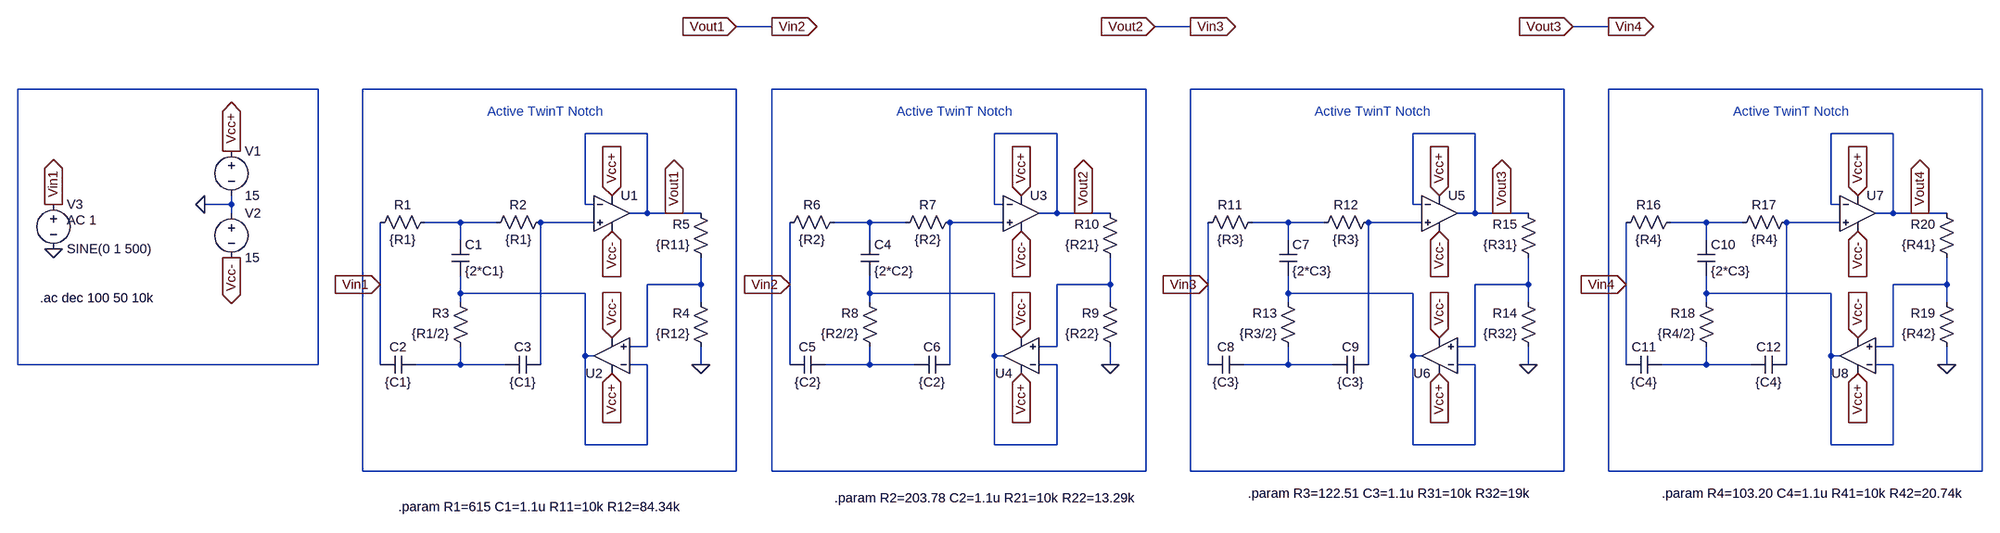
[diagram p0: schematic cascade.asc]
cascade.asc, the LTspice schematic file:
Version 4
SHEET 1 2720 680
WIRE 528 -240 464 -240
WIRE 1280 -240 1216 -240
WIRE 2032 -240 1968 -240
WIRE -288 -128 -848 -128
WIRE 464 -128 -208 -128
WIRE 1200 -128 528 -128
WIRE 1952 -128 1280 -128
WIRE 2704 -128 2032 -128
WIRE 304 -48 192 -48
WIRE 1040 -48 928 -48
WIRE 1792 -48 1680 -48
WIRE 2544 -48 2432 -48
WIRE -464 80 -464 64
WIRE -464 80 -512 80
WIRE 192 80 192 -48
WIRE 208 80 192 80
WIRE 928 80 928 -48
WIRE 944 80 928 80
WIRE 1680 80 1680 -48
WIRE 1696 80 1680 80
WIRE 2432 80 2432 -48
WIRE 2448 80 2432 80
WIRE -464 96 -464 80
WIRE 304 96 304 -48
WIRE 304 96 272 96
WIRE 352 96 304 96
WIRE 400 96 352 96
WIRE 1040 96 1040 -48
WIRE 1040 96 1008 96
WIRE 1088 96 1040 96
WIRE 1136 96 1088 96
WIRE 1792 96 1792 -48
WIRE 1792 96 1760 96
WIRE 1840 96 1792 96
WIRE 1888 96 1840 96
WIRE 2544 96 2544 -48
WIRE 2544 96 2512 96
WIRE 2592 96 2544 96
WIRE 2640 96 2592 96
WIRE -32 112 -96 112
WIRE 32 112 -32 112
WIRE 208 112 112 112
WIRE 704 112 640 112
WIRE 768 112 704 112
WIRE 944 112 848 112
WIRE 1456 112 1392 112
WIRE 1520 112 1456 112
WIRE 1696 112 1600 112
WIRE 2208 112 2144 112
WIRE 2272 112 2208 112
WIRE 2448 112 2352 112
WIRE -32 144 -32 112
WIRE 704 144 704 112
WIRE 1456 144 1456 112
WIRE 2208 144 2208 112
WIRE -176 224 -176 112
WIRE 400 224 400 176
WIRE 400 224 304 224
WIRE 560 224 560 112
WIRE 1136 224 1136 176
WIRE 1136 224 1040 224
WIRE 1312 224 1312 112
WIRE 1888 224 1888 176
WIRE 1888 224 1792 224
WIRE 2064 224 2064 112
WIRE 2640 224 2640 176
WIRE 2640 224 2544 224
WIRE -32 240 -32 208
WIRE 192 240 -32 240
WIRE 704 240 704 208
WIRE 928 240 704 240
WIRE 1456 240 1456 208
WIRE 1680 240 1456 240
WIRE 2208 240 2208 208
WIRE 2432 240 2208 240
WIRE -32 256 -32 240
WIRE 400 256 400 224
WIRE 704 256 704 240
WIRE 1136 256 1136 224
WIRE 1456 256 1456 240
WIRE 1888 256 1888 224
WIRE 2208 256 2208 240
WIRE 2640 256 2640 224
WIRE 304 336 304 224
WIRE 304 336 272 336
WIRE 1040 336 1040 224
WIRE 1040 336 1008 336
WIRE 1792 336 1792 224
WIRE 1792 336 1760 336
WIRE 2544 336 2544 224
WIRE 2544 336 2512 336
WIRE 192 352 192 240
WIRE 208 352 192 352
WIRE 928 352 928 240
WIRE 944 352 928 352
WIRE 1680 352 1680 240
WIRE 1696 352 1680 352
WIRE 2432 352 2432 240
WIRE 2448 352 2432 352
WIRE -848 368 -848 -128
WIRE -288 368 -288 -128
WIRE -288 368 -848 368
WIRE -176 368 -176 224
WIRE -32 368 -32 336
WIRE -32 368 -112 368
WIRE 48 368 -32 368
WIRE 112 368 112 112
WIRE 304 368 272 368
WIRE 400 368 400 336
WIRE 560 368 560 224
WIRE 704 368 704 336
WIRE 704 368 624 368
WIRE 784 368 704 368
WIRE 848 368 848 112
WIRE 1040 368 1008 368
WIRE 1136 368 1136 336
WIRE 1312 368 1312 224
WIRE 1456 368 1456 336
WIRE 1456 368 1376 368
WIRE 1536 368 1456 368
WIRE 1600 368 1600 112
WIRE 1792 368 1760 368
WIRE 1888 368 1888 336
WIRE 2064 368 2064 224
WIRE 2208 368 2208 336
WIRE 2208 368 2128 368
WIRE 2288 368 2208 368
WIRE 2352 368 2352 112
WIRE 2544 368 2512 368
WIRE 2640 368 2640 336
WIRE 192 512 192 352
WIRE 304 512 304 368
WIRE 304 512 192 512
WIRE 928 512 928 352
WIRE 1040 512 1040 368
WIRE 1040 512 928 512
WIRE 1680 512 1680 352
WIRE 1792 512 1792 368
WIRE 1792 512 1680 512
WIRE 2432 512 2432 352
WIRE 2544 512 2544 368
WIRE 2544 512 2432 512
WIRE -208 560 -208 -128
WIRE 464 560 464 -128
WIRE 464 560 -208 560
WIRE 528 560 528 -128
WIRE 1200 560 1200 -128
WIRE 1200 560 528 560
WIRE 1280 560 1280 -128
WIRE 1952 560 1952 -128
WIRE 1952 560 1280 560
WIRE 2032 560 2032 -128
WIRE 2704 560 2704 -128
WIRE 2704 560 2032 560
FLAG 400 368 0
FLAG 240 384 Vcc+
IOPIN 240 384 In
FLAG 240 64 Vcc+
IOPIN 240 64 In
FLAG 240 128 Vcc-
IOPIN 240 128 In
FLAG 240 320 Vcc-
IOPIN 240 320 In
FLAG -176 224 Vin1
IOPIN -176 224 In
FLAG 352 96 Vout1
IOPIN 352 96 Out
FLAG -464 -16 Vcc+
IOPIN -464 -16 Out
FLAG -464 176 Vcc-
IOPIN -464 176 Out
FLAG -512 80 0
FLAG -784 160 0
FLAG -784 80 Vin1
IOPIN -784 80 Out
FLAG 1136 368 0
FLAG 976 384 Vcc+
IOPIN 976 384 In
FLAG 976 64 Vcc+
IOPIN 976 64 In
FLAG 976 128 Vcc-
IOPIN 976 128 In
FLAG 976 320 Vcc-
IOPIN 976 320 In
FLAG 560 224 Vin2
IOPIN 560 224 In
FLAG 1088 96 Vout2
IOPIN 1088 96 Out
FLAG 1888 368 0
FLAG 1728 384 Vcc+
IOPIN 1728 384 In
FLAG 1728 64 Vcc+
IOPIN 1728 64 In
FLAG 1728 128 Vcc-
IOPIN 1728 128 In
FLAG 1728 320 Vcc-
IOPIN 1728 320 In
FLAG 1312 224 Vin3
IOPIN 1312 224 In
FLAG 1840 96 Vout3
IOPIN 1840 96 Out
FLAG 2640 368 0
FLAG 2480 384 Vcc+
IOPIN 2480 384 In
FLAG 2480 64 Vcc+
IOPIN 2480 64 In
FLAG 2480 128 Vcc-
IOPIN 2480 128 In
FLAG 2480 320 Vcc-
IOPIN 2480 320 In
FLAG 2064 224 Vin4
IOPIN 2064 224 In
FLAG 2592 96 Vout4
IOPIN 2592 96 Out
FLAG 464 -240 Vout1
IOPIN 464 -240 In
FLAG 528 -240 Vin2
IOPIN 528 -240 Out
FLAG 1216 -240 Vout2
IOPIN 1216 -240 In
FLAG 1280 -240 Vin3
IOPIN 1280 -240 Out
FLAG 1968 -240 Vout3
IOPIN 1968 -240 In
FLAG 2032 -240 Vin4
IOPIN 2032 -240 Out
SYMBOL res -80 96 R90
WINDOW 0 0 56 VBottom 2
WINDOW 3 32 56 VTop 2
SYMATTR InstName R1
SYMATTR Value {R1}
SYMBOL res 128 96 R90
WINDOW 0 0 56 VBottom 2
WINDOW 3 32 56 VTop 2
SYMATTR InstName R2
SYMATTR Value {R1}
SYMBOL res -16 352 R180
WINDOW 0 36 76 Left 2
WINDOW 3 36 40 Left 2
SYMATTR InstName R3
SYMATTR Value {R1/2}
SYMBOL res 416 352 R180
WINDOW 0 36 76 Left 2
WINDOW 3 36 40 Left 2
SYMATTR InstName R4
SYMATTR Value {R12}
SYMBOL res 416 192 R180
WINDOW 0 36 76 Left 2
WINDOW 3 36 40 Left 2
SYMATTR InstName R5
SYMATTR Value {R11}
SYMBOL cap -48 144 R0
SYMATTR InstName C1
SYMATTR Value {2*C1}
SYMBOL cap -112 352 R90
WINDOW 0 0 32 VBottom 2
WINDOW 3 32 32 VTop 2
SYMATTR InstName C2
SYMATTR Value {C1}
SYMBOL cap 112 352 R90
WINDOW 0 0 32 VBottom 2
WINDOW 3 32 32 VTop 2
SYMATTR InstName C3
SYMATTR Value {C1}
SYMBOL OpAmps\\UniversalOpAmp 240 96 R0
SYMATTR InstName U1
SYMBOL OpAmps\\UniversalOpAmp 240 352 R180
SYMATTR InstName U2
SYMBOL voltage -464 -32 R0
WINDOW 123 0 0 Left 0
WINDOW 39 0 0 Left 0
SYMATTR InstName V1
SYMATTR Value 15
SYMBOL voltage -464 80 R0
WINDOW 123 0 0 Left 0
WINDOW 39 0 0 Left 0
SYMATTR InstName V2
SYMATTR Value 15
SYMBOL voltage -784 64 R0
WINDOW 123 24 44 Left 2
WINDOW 39 0 0 Left 0
SYMATTR Value2 AC 1
SYMATTR InstName V3
SYMATTR Value SINE(0 1 500)
SYMBOL res 656 96 R90
WINDOW 0 0 56 VBottom 2
WINDOW 3 32 56 VTop 2
SYMATTR InstName R6
SYMATTR Value {R2}
SYMBOL res 864 96 R90
WINDOW 0 0 56 VBottom 2
WINDOW 3 32 56 VTop 2
SYMATTR InstName R7
SYMATTR Value {R2}
SYMBOL res 720 352 R180
WINDOW 0 36 76 Left 2
WINDOW 3 36 40 Left 2
SYMATTR InstName R8
SYMATTR Value {R2/2}
SYMBOL res 1152 352 R180
WINDOW 0 36 76 Left 2
WINDOW 3 36 40 Left 2
SYMATTR InstName R9
SYMATTR Value {R22}
SYMBOL res 1152 192 R180
WINDOW 0 36 76 Left 2
WINDOW 3 36 40 Left 2
SYMATTR InstName R10
SYMATTR Value {R21}
SYMBOL cap 688 144 R0
SYMATTR InstName C4
SYMATTR Value {2*C2}
SYMBOL cap 624 352 R90
WINDOW 0 0 32 VBottom 2
WINDOW 3 32 32 VTop 2
SYMATTR InstName C5
SYMATTR Value {C2}
SYMBOL cap 848 352 R90
WINDOW 0 0 32 VBottom 2
WINDOW 3 32 32 VTop 2
SYMATTR InstName C6
SYMATTR Value {C2}
SYMBOL OpAmps\\UniversalOpAmp 976 96 R0
SYMATTR InstName U3
SYMBOL OpAmps\\UniversalOpAmp 976 352 R180
SYMATTR InstName U4
SYMBOL res 1408 96 R90
WINDOW 0 0 56 VBottom 2
WINDOW 3 32 56 VTop 2
SYMATTR InstName R11
SYMATTR Value {R3}
SYMBOL res 1616 96 R90
WINDOW 0 0 56 VBottom 2
WINDOW 3 32 56 VTop 2
SYMATTR InstName R12
SYMATTR Value {R3}
SYMBOL res 1472 352 R180
WINDOW 0 36 76 Left 2
WINDOW 3 36 40 Left 2
SYMATTR InstName R13
SYMATTR Value {R3/2}
SYMBOL res 1904 352 R180
WINDOW 0 36 76 Left 2
WINDOW 3 36 40 Left 2
SYMATTR InstName R14
SYMATTR Value {R32}
SYMBOL res 1904 192 R180
WINDOW 0 36 76 Left 2
WINDOW 3 36 40 Left 2
SYMATTR InstName R15
SYMATTR Value {R31}
SYMBOL cap 1440 144 R0
SYMATTR InstName C7
SYMATTR Value {2*C3}
SYMBOL cap 1376 352 R90
WINDOW 0 0 32 VBottom 2
WINDOW 3 32 32 VTop 2
SYMATTR InstName C8
SYMATTR Value {C3}
SYMBOL cap 1600 352 R90
WINDOW 0 0 32 VBottom 2
WINDOW 3 32 32 VTop 2
SYMATTR InstName C9
SYMATTR Value {C3}
SYMBOL OpAmps\\UniversalOpAmp 1728 96 R0
SYMATTR InstName U5
SYMBOL OpAmps\\UniversalOpAmp 1728 352 R180
SYMATTR InstName U6
SYMBOL res 2160 96 R90
WINDOW 0 0 56 VBottom 2
WINDOW 3 32 56 VTop 2
SYMATTR InstName R16
SYMATTR Value {R4}
SYMBOL res 2368 96 R90
WINDOW 0 0 56 VBottom 2
WINDOW 3 32 56 VTop 2
SYMATTR InstName R17
SYMATTR Value {R4}
SYMBOL res 2224 352 R180
WINDOW 0 36 76 Left 2
WINDOW 3 36 40 Left 2
SYMATTR InstName R18
SYMATTR Value {R4/2}
SYMBOL res 2656 352 R180
WINDOW 0 36 76 Left 2
WINDOW 3 36 40 Left 2
SYMATTR InstName R19
SYMATTR Value {R42}
SYMBOL res 2656 192 R180
WINDOW 0 36 76 Left 2
WINDOW 3 36 40 Left 2
SYMATTR InstName R20
SYMATTR Value {R41}
SYMBOL cap 2192 144 R0
SYMATTR InstName C10
SYMATTR Value {2*C3}
SYMBOL cap 2128 352 R90
WINDOW 0 0 32 VBottom 2
WINDOW 3 32 32 VTop 2
SYMATTR InstName C11
SYMATTR Value {C4}
SYMBOL cap 2352 352 R90
WINDOW 0 0 32 VBottom 2
WINDOW 3 32 32 VTop 2
SYMATTR InstName C12
SYMATTR Value {C4}
SYMBOL OpAmps\\UniversalOpAmp 2480 96 R0
SYMATTR InstName U7
SYMBOL OpAmps\\UniversalOpAmp 2480 352 R180
SYMATTR InstName U8
TEXT 16 -88 Left 2 ;Active TwinT Notch
TEXT -144 624 Left 2 !.param R1=615 C1=1.1u R11=10k R12=84.34k
TEXT -808 248 Left 2 !.ac dec 100 50 10k
TEXT 752 -88 Left 2 ;Active TwinT Notch
TEXT 1504 -88 Left 2 ;Active TwinT Notch
TEXT 2256 -88 Left 2 ;Active TwinT Notch
TEXT 1384 600 Left 2 !.param R3=122.51 C3=1.1u R31=10k R32=19k
TEXT 640 608 Left 2 !.param R2=203.78 C2=1.1u R21=10k R22=13.29k
TEXT 2128 600 Left 2 !.param R4=103.20 C4=1.1u R41=10k R42=20.74k

The netlist it stands for:
* cascade.asc
R1 N006 Vin1 {R1}
R2 N007 N006 {R1}
R3 N022 N018 {R1/2}
R4 0 N014 {R12}
R5 N014 Vin2 {R11}
C1 N006 N018 {2*C1}
C2 N022 Vin1 {C1}
C3 N007 N022 {C1}
XU1 N007 Vin2 Vcc+ Vcc- Vin2 level1 Avol=1Meg GBW=10Meg Vos=0 En=0 Enk=0 In=0 Ink=0 Rin=500Meg  ; pins In+ In- V+ V- OUT
XU2 N014 N018 Vcc+ Vcc- N018 level1 Avol=1Meg GBW=10Meg Vos=0 En=0 Enk=0 In=0 Ink=0 Rin=500Meg  ; pins In+ In- V+ V- OUT
V1 Vcc+ 0 15
V2 0 Vcc- 15
V3 Vin1 0 SINE(0 1 500) AC 1
R6 N008 Vin2 {R2}
R7 N009 N008 {R2}
R8 N023 N019 {R2/2}
R9 0 N015 {R22}
R10 N015 Vin3 {R21}
C4 N008 N019 {2*C2}
C5 N023 Vin2 {C2}
C6 N009 N023 {C2}
XU3 N009 Vin3 Vcc+ Vcc- Vin3 level1 Avol=1Meg GBW=10Meg Vos=0 En=0 Enk=0 In=0 Ink=0 Rin=500Meg  ; pins In+ In- V+ V- OUT
XU4 N015 N019 Vcc+ Vcc- N019 level1 Avol=1Meg GBW=10Meg Vos=0 En=0 Enk=0 In=0 Ink=0 Rin=500Meg  ; pins In+ In- V+ V- OUT
R11 N010 Vin3 {R3}
R12 N011 N010 {R3}
R13 N024 N020 {R3/2}
R14 0 N016 {R32}
R15 N016 Vin4 {R31}
C7 N010 N020 {2*C3}
C8 N024 Vin3 {C3}
C9 N011 N024 {C3}
XU5 N011 Vin4 Vcc+ Vcc- Vin4 level1 Avol=1Meg GBW=10Meg Vos=0 En=0 Enk=0 In=0 Ink=0 Rin=500Meg  ; pins In+ In- V+ V- OUT
XU6 N016 N020 Vcc+ Vcc- N020 level1 Avol=1Meg GBW=10Meg Vos=0 En=0 Enk=0 In=0 Ink=0 Rin=500Meg  ; pins In+ In- V+ V- OUT
R16 N012 Vin4 {R4}
R17 N013 N012 {R4}
R18 N025 N021 {R4/2}
R19 0 N017 {R42}
R20 N017 Vout4 {R41}
C10 N012 N021 {2*C3}
C11 N025 Vin4 {C4}
C12 N013 N025 {C4}
XU7 N013 Vout4 Vcc+ Vcc- Vout4 level1 Avol=1Meg GBW=10Meg Vos=0 En=0 Enk=0 In=0 Ink=0 Rin=500Meg  ; pins In+ In- V+ V- OUT
XU8 N017 N021 Vcc+ Vcc- N021 level1 Avol=1Meg GBW=10Meg Vos=0 En=0 Enk=0 In=0 Ink=0 Rin=500Meg  ; pins In+ In- V+ V- OUT
* Active TwinT Notch
.param R1=615 C1=1.1u R11=10k R12=84.34k
.ac dec 100 50 10k
* Active TwinT Notch
* Active TwinT Notch
* Active TwinT Notch
.param R3=122.51 C3=1.1u R31=10k R32=19k
.param R2=203.78 C2=1.1u R21=10k R22=13.29k
.param R4=103.20 C4=1.1u R41=10k R42=20.74k
.lib UniversalOpAmp1.lib
.backanno
.end